# EAGLE design Sparkfun_TMP117_Qwiic (EAGLE 9.5.0)
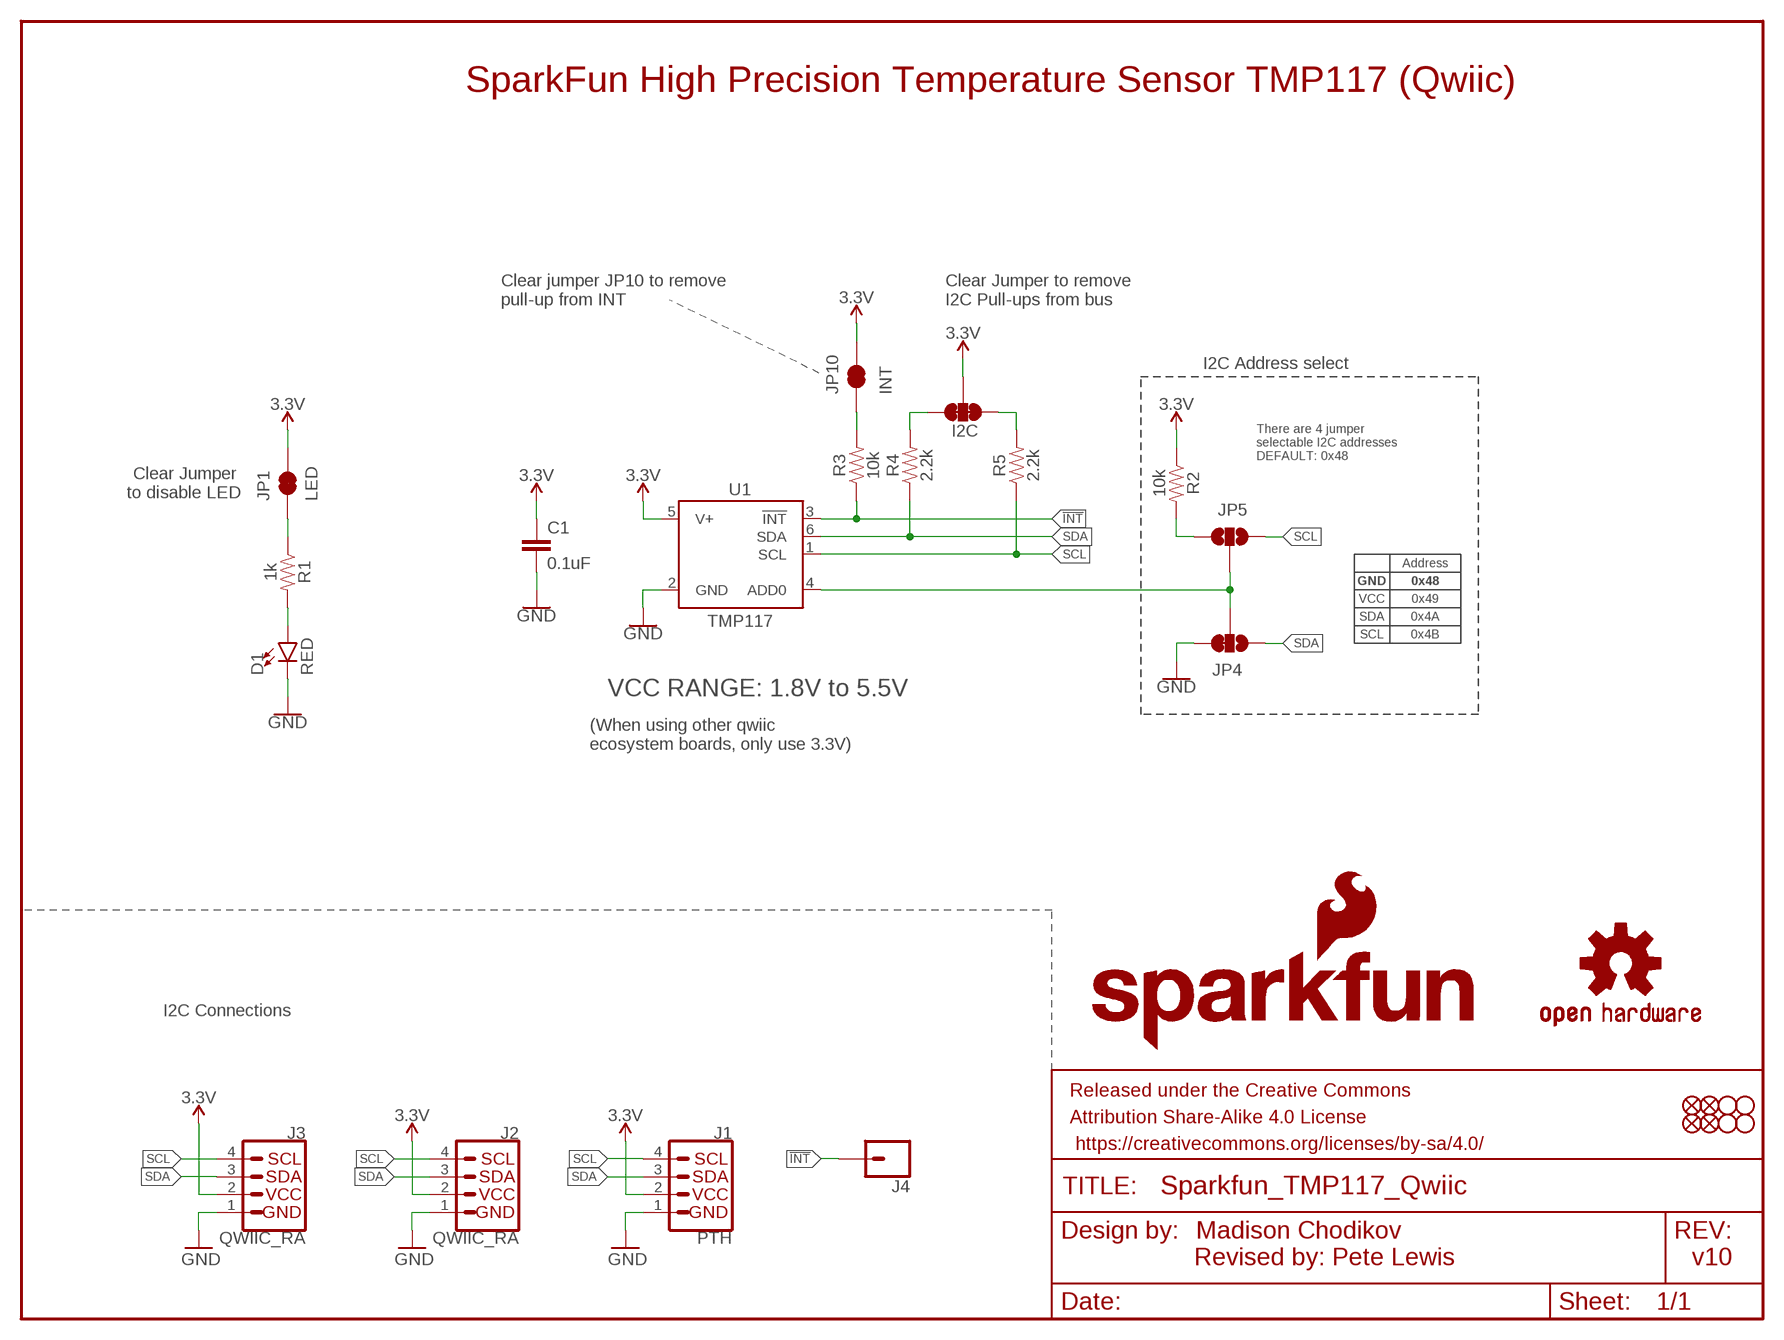
[diagram p0: schematic, sheet 1]

## Parts
C1  0.1uF  0.1UF-0603-25V-(+80/-20%)  [0603]
D1  RED  LED-RED0603  [LED-0603]
FD1  FIDUCIALUFIDUCIAL  [FIDUCIAL-MICRO]
FD2  FIDUCIALUFIDUCIAL  [FIDUCIAL-MICRO]
FD3  FIDUCIALUFIDUCIAL  [FIDUCIAL-MICRO]
FD4  FIDUCIALUFIDUCIAL  [FIDUCIAL-MICRO]
FRAME1  FRAME-LETTER  [CREATIVE_COMMONS]
I2C  JUMPER-SMT_3_2-NC_TRACE_SILK  [SMT-JUMPER_3_2-NC_TRACE_SILK]
J1  PTH  I2C_STANDARD_NO_SILK  [1X04_NO_SILK]
J2  QWIIC_RA  QWIIC_CONNECTORJS-1MM  [JST04_1MM_RA]
J3  QWIIC_RA  QWIIC_CONNECTORJS-1MM  [JST04_1MM_RA]
J4  CONN_01PTH_NO_SILK_YES_STOP  [1X01_NO_SILK]
JP1  LED  JUMPER-SMT_2_NC_TRACE_SILK  [SMT-JUMPER_2_NC_TRACE_SILK]
JP2  STAND-OFF  [STAND-OFF]
JP3  STAND-OFF  [STAND-OFF]
JP4  JUMPER-SMT_3_1-NC_TRACE_NO-SILK  [SMT-JUMPER_3_1-NC_TRACE_NO-SILK]
JP5  JUMPER-SMT_3_NO_NO_SILK  [SMT-JUMPER_3_0-NO_TRACE_NO-SILK]
JP8  STAND-OFF  [STAND-OFF]
JP9  STAND-OFF  [STAND-OFF]
JP10  INT  JUMPER-SMT_2_NC_TRACE_SILK  [SMT-JUMPER_2_NC_TRACE_SILK]
LOGO1  OSHW-LOGOMINI  [OSHW-LOGO-MINI]
LOGO4  SFE_LOGO_NAME_FLAME.1_INCH  [SFE_LOGO_NAME_FLAME_.1]
R1  1k  1KOHM-0603-1/10W-1%  [0603]
R2  10k  10KOHM-0603-1/10W-1%  [0603]
R3  10k  10KOHM-0603-1/10W-1%  [0603]
R4  2.2k  2.2KOHM-0603-1/10W-1%  [0603]
R5  2.2k  2.2KOHM-0603-1/10W-1%  [0603]
U1  TMP117  [TMP117]

## Nets
3.3V: C1.1 I2C.2 J1.2 J2.2 J3.2 JP1.2 JP10.2 R2.1 U1.5(V+)
!INT: J4.1 R3.1 U1.3(!INT)
ADD0: JP4.2 JP5.2 U1.4(ADD0)
GND: C1.2 D1.C J1.1 J2.1 J3.1 JP4.3 U1.2(GND)
N$1: D1.A R1.2
N$2: I2C.1 R5.2
N$3: I2C.3 R4.2
N$4: JP10.1 R3.2
N$7: JP5.1 R2.2
N$8: JP1.1 R1.1
SCL: J1.4 J2.4 J3.4 JP5.3 R5.1 U1.1(SCL)
SDA: J1.3 J2.3 J3.3 JP4.1 R4.1 U1.6(SDA)

## Notes on the sheet
- SparkFun High Precision Temperature Sensor TMP117 (Qwiic)
- Clear jumper JP10 to remove 
  pull-up from INT
- Clear Jumper to remove 
  I2C Pull-ups from bus
- I2C Address select
- There are 4 jumper 
  selectable I2C addresses
  DEFAULT: 0x48
- Clear Jumper 
  to disable LED
- Address
- GND | 0x48
- VCC | 0x49
- SDA | 0x4A
- SCL | 0x4B
- VCC RANGE: 1.8V to 5.5V
- (When using other qwiic 
  ecosystem boards, only use 3.3V)
- I2C Connections
- Madison Chodikov
- Revised by: Pete Lewis | v10

## Library data of the parts
C1 = SparkFun-Capacitors:0.1UF: 0.1µF ceramic capacitors A capacitor is a passive two-terminal electrical component used to store electrical energy temporarily in an electric field.; PROD_ID: CAP-00810
D1 = SparkFun-LED:LED-RED: Red SMD LED Used in manufacturing of most products at SparkFun Packages: 0603 - SMD 0603 package [Product Link] <http://docs.avagotech.com/docs/AV02-0551EN> 0603 SMART - SMD 0603 SMART package ( more efficient and expensive)[Product Link] <http://www.osram-os.com/Graphics/XPic2/00077099_0.pdf> 1206 - SMD1206 package [Product Link] <https://www.sparkfun.com/datasheets/DevTools/LilyPad/Q150OVS4.pdff> SparkFun Products: Pro Mini 328 -5V <https://www.sparkfun.com/products/821> RedBoard <https://www.sparkfun.com/products/12757> IOIO-OTG <https://www.sparkfun.com/products/13613>; PROD_ID: DIO-00819
FD1-FD4 = SparkFun-Aesthetics:FIDUCIAL: Fiducial Alignment Points Point-of-reference for pick-and-place machines and other optical instruments.
FRAME1 = SparkFun-Aesthetics:FRAME-LETTER: Schematic Frame - Letter Standard 8.5x11 US Letter frame
I2C = SparkFun-Jumpers:JUMPER-SMT_3_2-NC_TRACE: Normally closed trace jumper (2 of 2 connections) This jumper has a trace between all three pads so they are normally closed (NC). Use a razor knife to open the connection(s). For best results follow the IPC guidelines for cutting traces: Cutout at least 0.063 mm (0.005 in). Remove all loose material to clean up the cut area. Seal the cut with an approved epoxy. Reapply solder to reclose the connection(s).
J1 = SparkFun-Connectors:I2C_STANDARD: SparkFun I2C Standard Pinout Header SparkFun has standardized on a pinout for all I2C based sensor breakouts. This pinout allows I2C boards to be plugged directly into the headers on Arduino Uno compatible boards, and to be daisy chained easily. Example SparkFun Products: SparkFun Atmospheric Sensor Breakout - BME280 <https://www.sparkfun.com/products/13676> SparkFun Altitude/Pressure Sensor Breakout - MPL3115A2 <https://www.sparkfun.com/products/11084> SparkFun TOF Range Finder Sensor - VL6180 <https://www.sparkfun.com/products/12785>
J2 J3 = SparkFun-Connectors:QWIIC_CONNECTOR: SparkFun I2C Standard Qwiic Connector An SMD 1mm pitch JST connector makes it easy and quick (get it? Qwiic?) to connect I2C devices to each other. The Qwiic system <http://www.sparkfun.com/qwiic> enables fast and solderless connection between popular platforms and various sensors and actuators. We carry 200mm <https://www.sparkfun.com/products/14204>, 100mm <https://www.sparkfun.com/products/14205>, 50mm <https://www.sparkfun.com/products/14206>, and breadboard friendly <https://www.sparkfun.com/products/14207> Qwiic cables. We also offer 10 pcs strips <https://www.sparkfun.com/products/14323> the SMD connectors.; PROD_ID: CONN-13694; VALUE: QWIIC_RIGHT_ANGLE
J4 = SparkFun-Connectors:CONN_01: Single connection point. Often used as Generic Header-pin footprint for 0.1 inch spaced/style header connections On any of the 0.1 inch spaced packages, you can populate with these: Break Away Headers - Straight <https://www.sparkfun.com/products/116> (PRT-00116) Break Away Male Headers - Right Angle <https://www.sparkfun.com/products/553> (PRT-00553) Female Headers <https://www.sparkfun.com/products/115> (PRT-00115) Break Away Headers - Machine Pin <https://www.sparkfun.com/products/117> (PRT-00117) Break Away Female Headers - Swiss Machine Pin <https://www.sparkfun.com/products/743> (PRT-00743) This device is also useful as a general connection point to wire up your design to another part of your project. Our various solder wires solder well into these plated through hole pads. Hook-Up Wire - Assortment (Stranded, 22 AWG) <https://www.sparkfun.com/products/11375> (PRT-11375) Hook-Up Wire - Assortment (Solid Core, 22 AWG) <https://www.sparkfun.com/products/11367> (PRT-11367) View the entire wire category on our website here <https://www.sparkfun.com/categories/141> Special notes: SMTSO-256-ET is a "flush mount" nut for a 4-40 screw. We mostly use this on specialty testbeds; it is a nice way to connect hardware to your PCB at an adjustable hieght. Also note, the SNAP packages are for using a snappable style connector. We sell a baggie of snaps and they are also used on two LilyPad designs: Snap Assortment - 30 pack (male and female) <https://www.sparkfun.com/products/11347> (DEV-11347) LilyPad Arduino SimpleSnap <https://www.sparkfun.com/products/10941> (DEV-10941) LilyPad SimpleSnap Protoboard <https://www.sparkfun.com/products/10940> (DEV-10940)
JP1 JP10 = SparkFun-Jumpers:JUMPER-SMT_2_NC_TRACE: Normally closed trace jumper This jumper has a trace between two pads so it's normally closed (NC). Use a razor knife to open the connection. For best results follow the IPC guidelines for cutting traces: Cutout at least 0.063 mm (0.005 in). Remove all loose material to clean up the cut area. Seal the cut with an approved epoxy. Reapply solder to reclose the connection.
JP2 JP3 JP8 JP9 = SparkFun:STAND-OFF: Stand Off This is the mechanical footprint for a #4 phillips button head screw. Use the keepout ring to avoid running the screw head into surrounding components. SKU : PRT-00447
JP4 = SparkFun-Jumpers:JUMPER-SMT_3_1-NC_TRACE: Normally closed trace jumper (1 of 2 connections) This jumper has a trace between two pads so it's normally closed (NC). The other connection is normally open (NO). Use a razor knife to open the connection. For best results follow the IPC guidelines for cutting traces: Cutout at least 0.063 mm (0.005 in). Remove all loose material to clean up the cut area. Seal the cut with an approved epoxy. Reapply solder to reclose the connection, or to close the NO connection.
JP5 = SparkFun-Jumpers:JUMPER-SMT_3_NO: Normally open jumper This jumper has three pads in close proximity to each other. Apply solder to close the connection(s).
LOGO1 = SparkFun-Aesthetics:OSHW-LOGO: Open-Source Hardware (OSHW) Logo This logo indicates the piece of hardware it is found on incorporates a OSHW license and/or adheres to the definition of open source hardware found here: http://freedomdefined.org/OSHW
LOGO4 = SparkFun-Aesthetics:SFE_LOGO_NAME_FLAME: SparkFun Font Logo w/ Flame This is the SparkFun full logo. The logo on the schematic will always be the same size; the package variant is the height of the flame part of the logo. Default layer for the logo on the board is tSilk.
R1 = SparkFun-Resistors:1KOHM: 1kΩ resistor A resistor is a passive two-terminal electrical component that implements electrical resistance as a circuit element. Resistors act to reduce current flow, and, at the same time, act to lower voltage levels within circuits. - Wikipedia; PROD_ID: RES-07856
R2 R3 = SparkFun-Resistors:10KOHM: 10kΩ resistor A resistor is a passive two-terminal electrical component that implements electrical resistance as a circuit element. Resistors act to reduce current flow, and, at the same time, act to lower voltage levels within circuits. - Wikipedia; PROD_ID: RES-00824
R4 R5 = SparkFun-Resistors:2.2KOHM: 2.2kΩ resistor A resistor is a passive two-terminal electrical component that implements electrical resistance as a circuit element. Resistors act to reduce current flow, and, at the same time, act to lower voltage levels within circuits. - Wikipedia; PROD_ID: RES-08272
U1 = SparkFun-Sensors:TMP117: Temperature Sensor TMP117x High-Accuracy, Low-Power, Digital Temperature Sensor With SMBus™- and I2C-Compatible Interface; PROD_ID: IC-14700

## Board
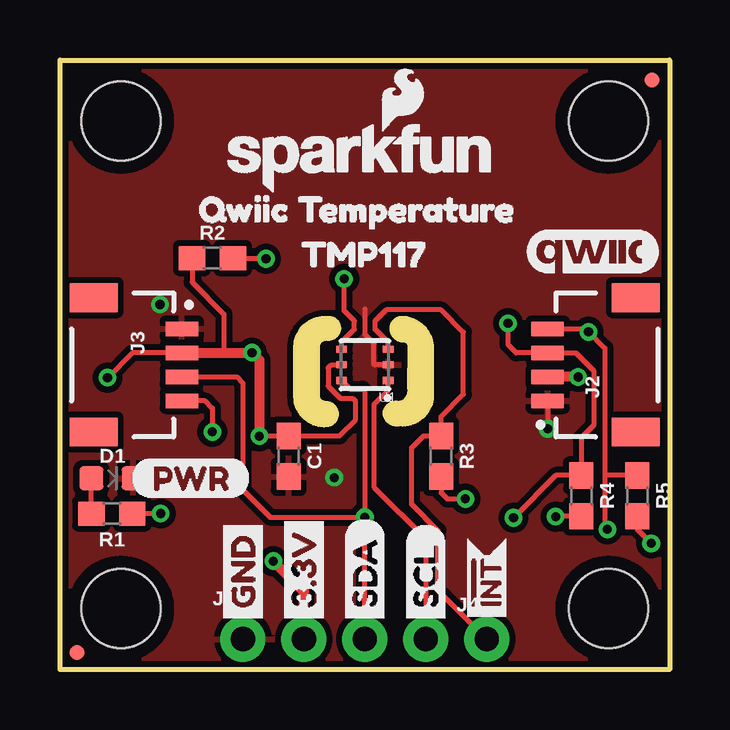
[diagram p1: board, top side]
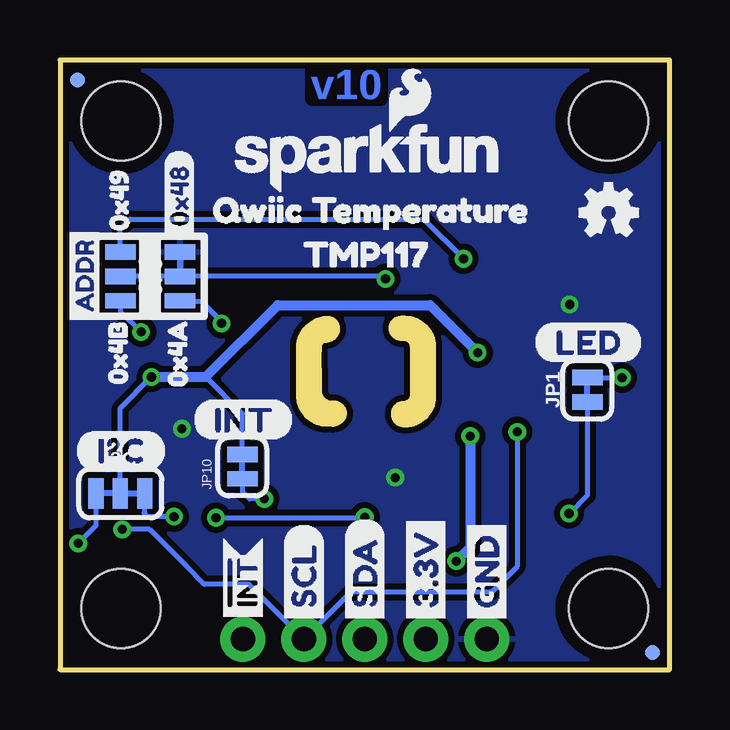
[diagram p2: board, bottom side, seen from below]

Size 25.4 x 25.4 mm. Coordinates in mm from the lower left corner, seen from the top.
Outline: 0,0 0,25.4 25.4,25.4 25.4,0 0,0
Outline: 10.72,13.44 10.72,11.48 arc90 10.99,11.11 11.11,11.09 arc-90 11.51,10.64 arc-90 11.09,10.2 10.99,10.2 arc-90 9.83,11.38 9.83,13.46 arc-90 11.02,14.63 11.2,14.63 arc-90 11.61,14.22 arc-90 11.17,13.8 11.06,13.8 arc90 10.72,13.44
Outline: 14.58,11.68 14.59,13.45 arc90 14.35,13.73 arc-90 13.83,14.18 arc-90 14.22,14.59 arc-90 15.47,13.49 15.47,11.4 arc-90 14.28,10.24 14.1,10.24 arc-90 13.54,10.67 arc-90 14.02,11.1 14.13,11.1 arc90 14.58,11.68
Copper layers (1*16): Top 0.035mm / dielectric 1.5mm / Bottom 0.035mm
Design rules "SparkFun-2-layer-TIGHT": minimum track width 7mil, minimum drill 15mil, track to track 7mil, track to pad 7mil, pad to pad 7mil, via to via 7mil, smd to smd 7mil, copper to edge 7mil, drill to drill 7mil, minimum pad ring 7mil, minimum via ring 7mil, stop-mask expansion 4mil, vias tented up to drill 25mil, thermal gap 10mil
Milling: 10 lines

### Footprints (pad centres in the part's own frame; a part is rotated, then mirrored left to right if it is on the bottom)
0603 = smd 1.1 x 1: 1 -0.85,0; 2 0.85,0
LED-0603 = smd 1 x 1: A -0.877,0; C 0.877,0
FIDUCIAL-MICRO = smd 0.635 x 0.635: 1 0,0
SMT-JUMPER_3_2-NC_TRACE_SILK = smd 0.635 x 1.27: 1 -1.016,0; 2 0,0; 3 1.016,0
1X04_NO_SILK = drill 1.016 pad 1.88: 1 0,0; 2 2.54,0; 3 5.08,0; 4 7.62,0
JST04_1MM_RA = smd 0.6 x 1.35: 1 -1.5,0; 2 -0.5,0; 3 0.5,0; 4 1.5,0 | smd 1.2 x 2: NC1 2.8,-3.675; NC2 -2.8,-3.675
1X01_NO_SILK = drill 1.016 pad 1.88: 1 0,0
SMT-JUMPER_2_NC_TRACE_SILK = smd 0.635 x 1.27: 1 -0.508,0; 2 0.508,0
STAND-OFF = hole 3.302: 0,0
SMT-JUMPER_3_1-NC_TRACE_NO-SILK = smd 0.635 x 1.27: 1 -1.016,0; 2 0,0; 3 1.016,0
SMT-JUMPER_3_0-NO_TRACE_NO-SILK = smd 0.635 x 1.27: 1 -1.016,0; 2 0,0; 3 1.016,0
TMP117 = smd 0.45 x 0.3: 1 -0.975,0.65; 2 -0.975,0; 3 -0.975,-0.65; 4 0.975,-0.65; 5 0.975,0; 6 0.975,0.65

### Placement (x,y rotation side)
C1  9.53,8.89 270 top
D1  2.18,7.98 0 top
FD1  0.71,0.71 0 top
FD2  24.66,24.56 0 top
FD3  24.66,24.56 0 bottom
FD4  0.71,0.71 0 bottom
FRAME1  -7.62,-8.89 0 top  (outside the outline)
I2C  22.89,7.34 0 bottom
J1  7.62,1.27 0 top
J2  20.32,12.7 90 top
J3  5.08,12.7 270 top
J4  17.78,1.27 0 top
JP1  3.43,11.66 90 bottom
JP2  2.54,2.54 0 top
JP3  22.86,2.54 0 top
JP4  20.4,16.38 90 bottom
JP5  22.89,16.38 270 bottom
JP8  22.86,22.86 0 top
JP9  2.54,22.86 0 top
JP10  17.81,8.46 90 bottom
LOGO1  2.54,19.05 0 bottom
LOGO2  SFE_LOGO_NAME_FLAME.1_INCH  [SFE_LOGO_NAME_FLAME_.1]  12.55,21.34 0 bottom
LOGO4  12.55,21.34 0 top
R1  2.16,6.5 180 top
R2  6.35,17.14 0 top
R3  15.88,8.89 270 top
R4  21.72,7.24 270 top
R5  24.05,7.24 270 top
U1  12.7,12.7 180 top
U$1  [QWIIC_TEMPERATURE2]  19.94,19.15 0 bottom
U$2  [0X491]  22.94,17.61 90 bottom
U$3  [INT#-[<-04]  17.78,1.52 90 top
U$4  [TMP1171]  9.14,17.3 0 top
U$5  [TMP1171]  16.15,17.3 0 bottom
U$6  [QWIIC_TEMPERATURE2]  4.88,19.18 0 top
U$7  [INT-()-04]  19.91,10.41 0 bottom
U$8  [LED0]  5.69,13.64 0 bottom
U$9  [SCL-[)]  15.24,1.65 90 bottom
U$10  [GND-04]  7.62,1.65 90 top
U$11  [INT#-[<-04]  17.78,1.52 90 bottom
U$12  [SCL-[)]  15.24,1.65 90 top
U$13  [SDA-[)]  12.7,1.65 90 top
U$14  [SDA-[)]  12.7,1.65 90 bottom
U$15  [QWIIC_5.5MM]  22.2,17.42 0 top
U$16  [0X4A2]  20.51,11.09 90 bottom
U$17  [0X4B3]  22.99,11.22 90 bottom
U$18  [ADDR0]  24.38,14.22 90 bottom
U$19  [3.3V]  10.16,1.65 90 top
U$20  [PWR-()-04]  2.95,7.98 0 top
U$21  [I_SUPER2_C-()-04]  24.77,9.12 0 bottom
U$22  [3.3V]  10.16,1.65 90 bottom
U$23  [GND-04]  7.62,1.65 90 bottom
U$42  [0X480]  20.43,17.79 90 bottom

### Tracks (layer width: path | path; a pad name or v marks a point on that pad's centre or on a via)
3.3V  (via drill 0.38)
  Top 0.203: J2.2 | v7.99,13.2 v8,13.21 | U1.5 11.3,12.7 11.18,12.57 11.18,11.81 11.68,11.3 12.19,11.3 12.32,11.18 12.32,10.41 11.64,9.74 C1.1 9.51,9.73 v8.31,9.73 | R2.1 5.5,16.14 6.83,14.81 6.83,13.2 | J3.2 3.02,13.2 v1.98,12.17
  Top 0.406: v21.59,12.19 J2.2 | J3.2 6.83,13.2 v7.99,13.2 | J1.2 10.16,3.25 v8.89,4.52 | v8,13.21 8.31,12.9 v8.31,9.73
  Bottom 0.203: JP10.2 17.8,10.67 19.33,12.19 | I2C.2 22.89,10.9 v21.59,12.19 | JP1.2 v1.98,12.17
  Bottom 0.406: v21.59,12.19 19.33,12.19 16.33,15.19 9.98,15.19 v8,13.21 | v8.31,9.73 8.31,5.11 v8.89,4.52
!INT
  Top 0.203: U1.3 13.68,13.63 13.13,14.17 13.13,14.53 13.59,14.99 15.88,14.99 16.8,14.06 16.8,11.47 15.88,10.54 R3.1 15.15,9.74 14.66,9.25 14.66,6.88 15.75,5.79 15.75,3.3 J4.1
ADD0  (via drill 0.38)
  Top 0.203: U1.4 11.72,13.63 12.27,14.17 12.27,14.53 11.84,14.96 v11.84,16.28
  Bottom 0.203: v11.84,16.28 11.94,16.38 JP4.2 JP5.2
GND  (via drill 0.38)
  Top 0.203: U1.2 13.12,12.7 13.08,12.73 13.08,13.59 12.7,13.97 12.7,15.03 | J2.1 v20.32,10.03
  other vias: 11.43,8 4.17,15.21
  pour Top (isolate 0.254): 25.4,0 25.4,25.4 0,25.4 0,0
  pour Bottom (isolate 0.254): 25.4,0 25.4,25.4 0,25.4 0,0
N$1
  Top 0.203: R1.2 D1.A
N$2  (via drill 0.38)
  Top 0.203: v24.64,5.26 24.05,5.84 R5.2
  Bottom 0.203: I2C.1 23.9,5.99 v24.64,5.26
N$3  (via drill 0.38)
  Top 0.203: R4.2 20.66,6.39 v20.65,6.38
  Bottom 0.203: v20.65,6.38 21.74,6.38 21.89,6.53 21.89,7.32 I2C.3
N$4  (via drill 0.38)
  Top 0.203: R3.2 15.88,7.37 16.13,7.11 v16.89,7.11
  Bottom 0.203: JP10.1 17.8,7.42 17.5,7.11 v16.89,7.11
N$7  (via drill 0.38)
  Top 0.203: v8.59,17.12 7.22,17.12 R2.2
  Bottom 0.203: JP5.1 22.89,18.36 22.48,18.77 10.24,18.77 v8.59,17.12
N$8  (via drill 0.38)
  Top 0.203: v4.19,6.5 R1.1
  Bottom 0.203: JP1.1 3.43,7.26 v4.19,6.5
SCL  (via drill 0.38)
  Top 0.203: J3.4 6.04,11.2 6.35,10.9 v6.35,9.91 | U1.1 13.68,11.64 13.08,11.05 13.08,7.61 15.24,5.45 J1.4 | J2.4 21.89,14.2 v22.02,14.07 22.7,13.39 22.7,10.62 22.7,8.1 | v22.81,5.84 22.7,5.95 22.7,8.1 | R5.1 22.72,8.09 22.7,8.1
  Bottom 0.203: v6.35,9.91 6.35,4.29 7.42,3.23 13.28,3.23 J1.4 17.53,3.56 19.38,3.56 20.14,4.32 21.67,5.84 v22.81,5.84 | JP5.3 22.89,14.94 v22.02,14.07
SDA  (via drill 0.38)
  Top 0.203: J3.3 7.37,12.19 7.62,11.94 7.62,7.48 8.75,6.35 v12.7,6.35 | U1.6 12.09,11.68 12.6,11.68 12.7,11.59 v12.7,6.35 | v18.67,14.43 18.67,13.54 19.01,13.2 J2.3 21.5,13.2 22.24,12.46 22.24,10.17 21.72,9.65 R4.1 20.66,8.09 v18.9,6.33 | J1.3 v12.7,6.35
  Bottom 0.203: JP4.1 20.37,15.34 19.51,15.34 18.67,14.5 v18.67,14.43 | v18.9,6.33 12.72,6.33 v12.7,6.35

### Text on the board
Bottom: v10
Dimension: ROUTE OUT | ROUTE OUT
tDocu: Madison Chodikov | Revised by: Pete Lewis